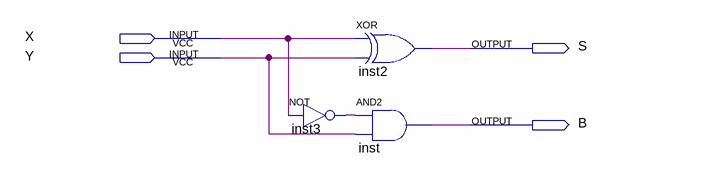
[diagram p0: schematic sheet]
// Quartus schematic Meio_Subtrator.bdf as structural Verilog: 3 symbols, 4 pins
module Meio_Subtrator (
  input  X,
  input  Y,
  output S,
  output B
);

  wire inst3_out;

  not inst3 (inst3_out, X);
  xor inst2 (S, X, Y);
  and inst (B, inst3_out, Y);
endmodule
